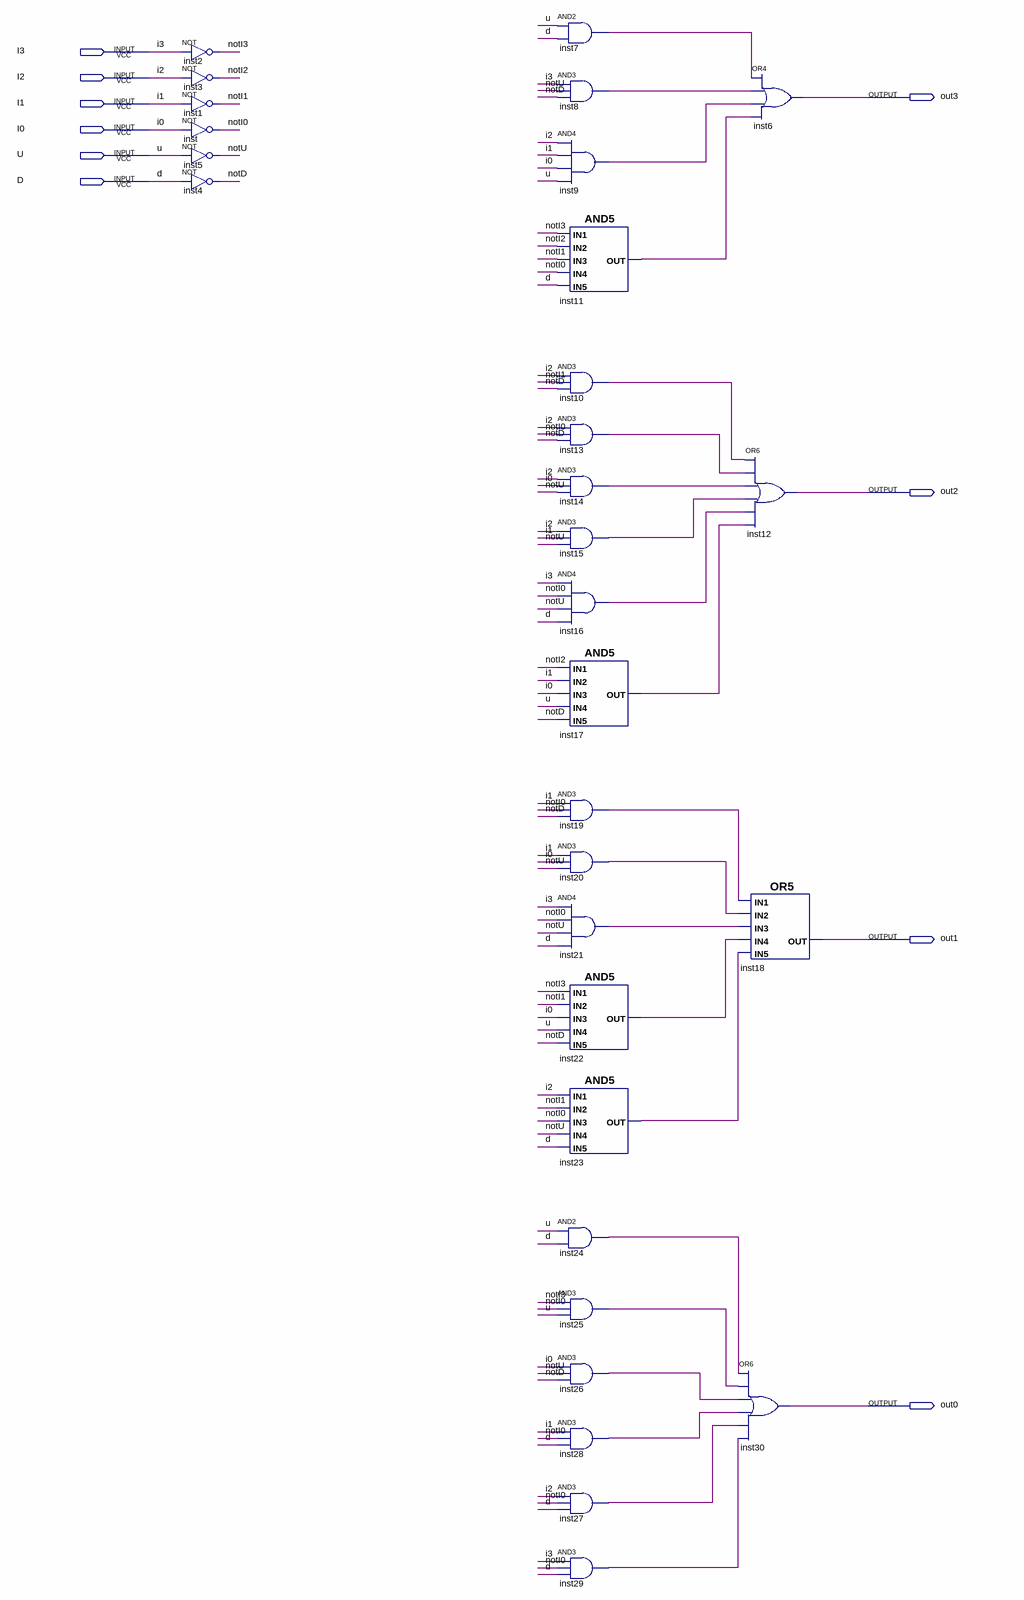
[diagram p0: schematic sheet]
// Quartus schematic input_circuit.bdf as structural Verilog: 31 symbols, 10 pins
module input_circuit (
  input  I3,
  input  I2,
  input  I1,
  input  I0,
  input  U,
  input  D,
  output out3,
  output out2,
  output out1,
  output out0
);

  wire inst7_out, inst8_out, inst9_out, inst10_out, inst11_out, inst13_out, inst14_out, inst15_out,
       inst16_out, inst17_out, inst19_out, inst20_out, inst21_out, inst22_out, inst23_out, inst24_out,
       inst25_out, inst26_out, inst27_out, inst28_out, inst29_out, notD, notI0, notI1, notI2, notI3, notU;

  not inst2 (notI3, I3);
  not inst3 (notI2, I2);
  not inst1 (notI1, I1);
  not inst (notI0, I0);
  not inst5 (notU, U);
  not inst4 (notD, D);
  and inst7 (inst7_out, U, D);
  and inst8 (inst8_out, I3, notU, notD);
  and inst9 (inst9_out, I2, I1, I0, U);
  and inst11 (inst11_out, notI3, notI2, notI1, notI0, D);
  and inst10 (inst10_out, I2, notI1, notD);
  and inst13 (inst13_out, I2, notI0, notD);
  and inst14 (inst14_out, I2, I0, notU);
  and inst15 (inst15_out, I2, I1, notU);
  and inst16 (inst16_out, I3, notI0, notU, D);
  and inst17 (inst17_out, notI2, I1, I0, U, notD);
  and inst19 (inst19_out, I1, notI0, notD);
  and inst20 (inst20_out, I1, I0, notU);
  and inst21 (inst21_out, I3, notI0, notU, D);
  and inst22 (inst22_out, notI3, notI1, I0, U, notD);
  and inst23 (inst23_out, I2, notI1, notI0, notU, D);
  and inst24 (inst24_out, U, D);
  and inst25 (inst25_out, notI3, notI0, U);
  and inst26 (inst26_out, I0, notU, notD);
  and inst28 (inst28_out, I1, notI0, D);
  and inst27 (inst27_out, I2, notI0, D);
  and inst29 (inst29_out, I3, notI0, D);
  or inst18 (out1, inst19_out, inst20_out, inst21_out, inst22_out, inst23_out);
  or inst30 (out0, inst24_out, inst25_out, inst26_out, inst28_out, inst27_out, inst29_out);
  or inst6 (out3, inst7_out, inst8_out, inst9_out, inst11_out);
  or inst12 (out2, inst10_out, inst13_out, inst14_out, inst15_out, inst16_out, inst17_out);
endmodule
